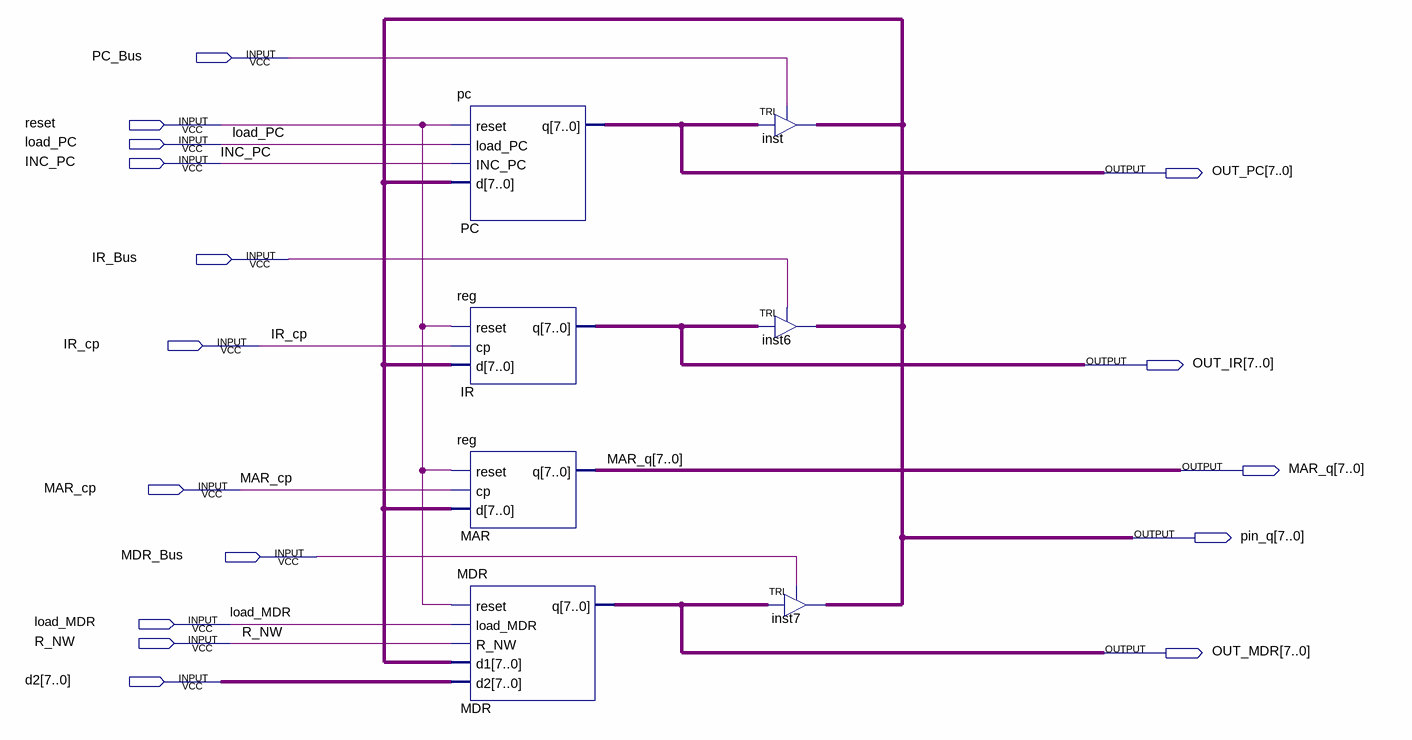
[diagram p0: schematic sheet]
// Quartus schematic regs.bdf as structural Verilog: 7 symbols, 16 pins
module regs (
  input  PC_Bus,
  input  reset,
  input  load_PC,
  input  INC_PC,
  input  IR_Bus,
  input  IR_cp,
  input  MAR_cp,
  input  MDR_Bus,
  input  load_MDR,
  input  R_NW,
  input  [7:0] d2,
  output [7:0] OUT_PC,
  output [7:0] OUT_IR,
  output [7:0] MAR_q,
  output [7:0] pin_q,
  output [7:0] OUT_MDR
);

  pc PC (.reset(reset), .load_PC(load_PC), .INC_PC(INC_PC), .d(pin_q), .q(OUT_PC));
  \reg  IR (.reset(reset), .cp(IR_cp), .d(pin_q), .q(OUT_IR));
  \reg  MAR (.reset(reset), .cp(MAR_cp), .d(pin_q), .q(MAR_q));
  MDR MDR (.reset(reset), .load_MDR(load_MDR), .R_NW(R_NW), .d1(pin_q), .d2(d2), .q(OUT_MDR));
  TRI inst[7:0] (.IN(OUT_PC), .OE(PC_Bus), .OUT(pin_q));
  TRI inst6[7:0] (.IN(OUT_IR), .OE(IR_Bus), .OUT(pin_q));
  TRI inst7[7:0] (.IN(OUT_MDR), .OE(MDR_Bus), .OUT(pin_q));
endmodule
